# EAGLE design universal_opamp_circuit_REV1 (EAGLE 7.5.0)
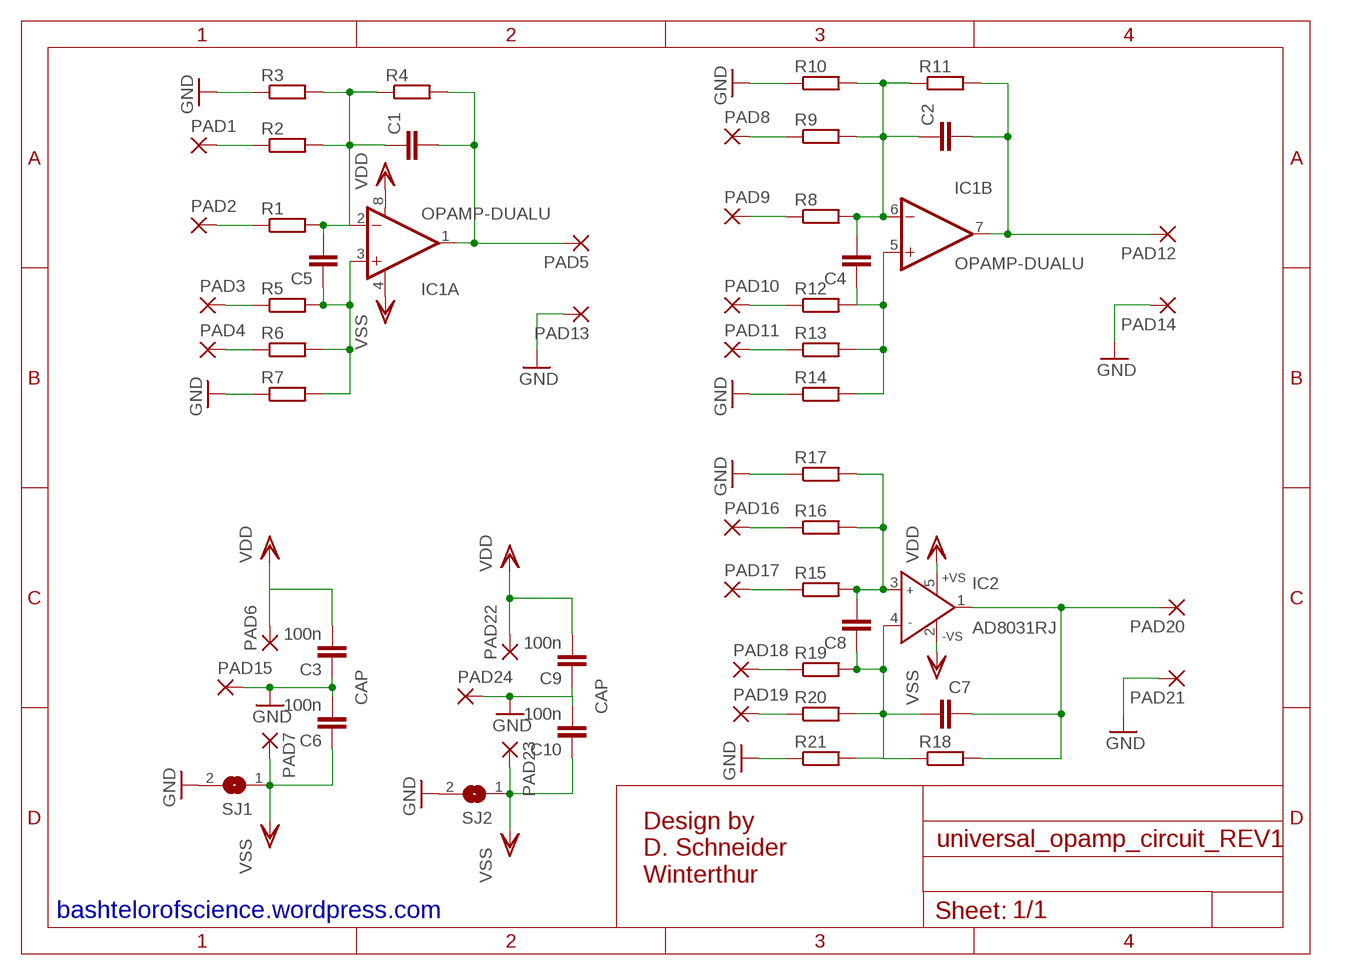
[diagram p0: schematic, sheet 1]

## Parts
C1  C-EUC0603  [C0603]
C2  C-EUC0603  [C0603]
C3  100n  C-EUC0603  [C0603]
C4  C-EUC0603  [C0603]
C5  C-EUC0603  [C0603]
C6  100n  C-EUC0603  [C0603]
C7  C-EUC0603  [C0603]
C8  C-EUC0603  [C0603]
C9  100n  C-EUC0603  [C0603]
C10  100n  C-EUC0603  [C0603]
IC1  OPAMP-DUALU  [SO08]
IC2  AD8031RJ  [SOT23-5]
PAD1  1,6/0,9  [1,6/0,9]
PAD2  1,6/0,9  [1,6/0,9]
PAD3  1,6/0,9  [1,6/0,9]
PAD4  1,6/0,9  [1,6/0,9]
PAD5  1,6/0,9  [1,6/0,9]
PAD6  1,6/0,9  [1,6/0,9]
PAD7  1,6/0,9  [1,6/0,9]
PAD8  1,6/0,9  [1,6/0,9]
PAD9  1,6/0,9  [1,6/0,9]
PAD10  1,6/0,9  [1,6/0,9]
PAD11  1,6/0,9  [1,6/0,9]
PAD12  1,6/0,9  [1,6/0,9]
PAD13  1,6/0,9  [1,6/0,9]
PAD14  1,6/0,9  [1,6/0,9]
PAD15  1,6/0,9  [1,6/0,9]
PAD16  1,6/0,9  [1,6/0,9]
PAD17  1,6/0,9  [1,6/0,9]
PAD18  1,6/0,9  [1,6/0,9]
PAD19  1,6/0,9  [1,6/0,9]
PAD20  1,6/0,9  [1,6/0,9]
PAD21  1,6/0,9  [1,6/0,9]
PAD22  1,6/0,9  [1,6/0,9]
PAD23  1,6/0,9  [1,6/0,9]
PAD24  1,6/0,9  [1,6/0,9]
R1  R-EU_R0603  [R0603]
R2  R-EU_R0603  [R0603]
R3  R-EU_R0603  [R0603]
R4  R-EU_R0603  [R0603]
R5  R-EU_R0603  [R0603]
R6  R-EU_R0603  [R0603]
R7  R-EU_R0603  [R0603]
R8  R-EU_R0603  [R0603]
R9  R-EU_R0603  [R0603]
R10  R-EU_R0603  [R0603]
R11  R-EU_R0603  [R0603]
R12  R-EU_R0603  [R0603]
R13  R-EU_R0603  [R0603]
R14  R-EU_R0603  [R0603]
R15  R-EU_R0603  [R0603]
R16  R-EU_R0603  [R0603]
R17  R-EU_R0603  [R0603]
R18  R-EU_R0603  [R0603]
R19  R-EU_R0603  [R0603]
R20  R-EU_R0603  [R0603]
R21  R-EU_R0603  [R0603]
SJ1  SJ  [SJ]
SJ2  SJ  [SJ]

## Nets
GND: C3.1 C6.2 C9.1 C10.2 PAD13.1(P) PAD14.1(P) PAD15.1(P) PAD21.1(P) PAD24.1(P) R3.1 R7.1 R10.1 R14.1 R17.1 R21.1 SJ1.2 SJ2.2
N$1: C2.1 C4.2 IC1.6(B:-IN) R8.2 R9.2 R10.2 R11.1
N$2: C2.2 IC1.7(B:OUT) PAD12.1(P) R11.2
N$3: PAD1.1(P) R2.1
N$4: C4.1 IC1.5(B:+IN) R12.2 R13.2 R14.2
N$5: C5.1 IC1.3(A:+IN) R5.2 R6.2 R7.2
N$6: PAD2.1(P) R1.1
N$7: PAD3.1(P) R5.1
N$8: PAD4.1(P) R6.1
N$9: PAD8.1(P) R9.1
N$10: PAD11.1(P) R13.1
N$11: C8.2 IC2.3(IN+) R15.2 R16.2 R17.2
N$12: C7.2 IC2.1(OUT) PAD20.1(P) R18.2
N$13: C1.1 C5.2 IC1.2(A:-IN) R1.2 R2.2 R3.2 R4.1
N$14: C1.2 IC1.1(A:OUT) PAD5.1(P) R4.2
N$15: PAD9.1(P) R8.1
N$16: PAD10.1(P) R12.1
N$17: C7.1 C8.1 IC2.4(IN-) R18.1 R19.2 R20.2 R21.2
N$18: PAD16.1(P) R16.1
N$19: PAD17.1(P) R15.1
N$20: PAD18.1(P) R19.1
N$21: PAD19.1(P) R20.1
VDD: C3.2 C9.2 IC1.8(A:V+) IC2.5(+VS) PAD6.1(P) PAD22.1(P)
VSS: C6.1 C10.1 IC1.4(A:V-) IC2.2(-VS) PAD7.1(P) PAD23.1(P) SJ1.1 SJ2.1

## Notes on the sheet
- CAP
- CAP
- Design by
  D. Schneider
  Winterthur
- bashtelorofscience.wordpress.com

## Library data of the parts
C1-C10 = resistor:C-EU: CAPACITOR, European symbol
IC1 = SparkFun-AnalogIC:OPAMP-DUAL: Generic op-amp footprint
IC2 = analog-devices:AD8031: 2.7 V, 800 ?A, 80 MHz Rail-to-Rail I/O Amplifiers Source: http://www.analog.com/static/imported-files/data_sheets/AD8031_8032.pdf; MPN: AD8031ARTZ-REEL7; OC_FARNELL: 1660972; OC_NEWARK: 84R8399
PAD1-PAD24 = wirepad:1,6/0,9: THROUGH-HOLE PAD
R1-R21 = resistor:R-EU_: RESISTOR, European symbol
SJ1 SJ2 = jumper:SJ: SMD solder JUMPER

## Board
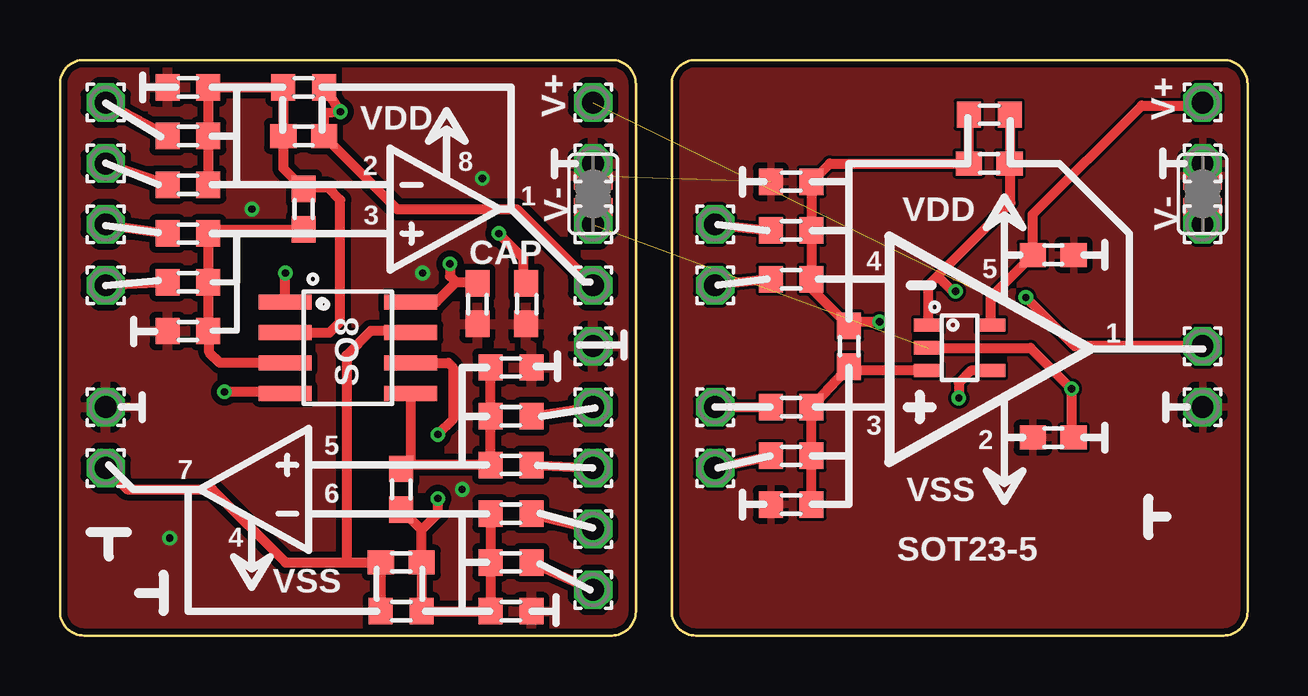
[diagram p1: board, top side]
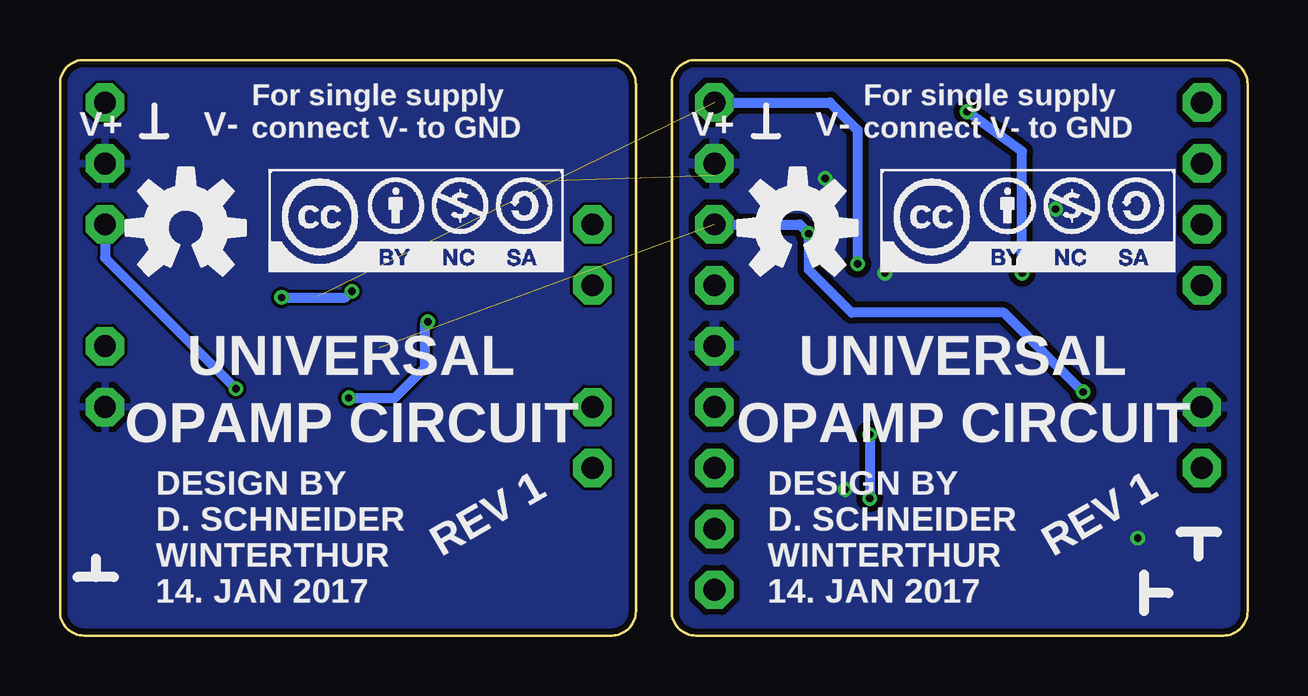
[diagram p2: board, bottom side, seen from below]

Size 49.5 x 24 mm. Coordinates in mm from the lower left corner, seen from the top.
Outline: 0,23 0,1 arc90 1,0 23,0 arc90 24,1 24,23 arc90 23,24 1,24 arc90 0,23
Outline: 25.5,23 25.5,1 arc90 26.5,0 48.5,0 arc90 49.5,1 49.5,23 arc90 48.5,24 26.5,24 arc90 25.5,23
Copper layers (1*16): Top 0.035mm / dielectric 1.5mm / Bottom 0.035mm
Design rules "dirt_cheap_dirty_boards.v1": minimum track width 5mil, minimum drill 12mil, track to track 5mil, track to pad 5mil, pad to pad 5mil, via to via 5mil, smd to smd 0mil, copper to edge 10mil, drill to drill 10mil, minimum pad ring 10mil, minimum via ring 6mil, stop-mask expansion 2mil, vias tented up to drill 25mil, thermal gap 10mil

### Footprints (pad centres in the part's own frame; a part is rotated, then mirrored left to right if it is on the bottom)
C0603 = smd 1.1 x 1: 1 -0.85,0; 2 0.85,0
SO08 = smd 0.61 x 2.21: 1 -1.905,-2.616; 2 -0.635,-2.616; 3 0.635,-2.616; 4 1.905,-2.616; 5 1.905,2.616; 6 0.635,2.616; 7 -0.635,2.616; 8 -1.905,2.616
SOT23-5 = smd 0.55 x 1.2: 1 -0.95,-1.3; 2 0,-1.3; 3 0.95,-1.3; 4 0.95,1.3; 5 -0.95,1.3
1,6/0,9 = drill 0.914 pad 1.6 octagon: 1 0,0
R0603 = smd 1 x 1.1: 1 -0.85,0; 2 0.85,0
SJ = smd 1.168 x 1.6: 1 -0.762,0; 2 0.762,0

### Placement (x,y rotation side)
C1  10.16,20.83 0 top
C2  14.22,3.05 180 top
C3  17.4,13.84 90 top
C4  14.22,6.1 270 top
C5  10.16,17.78 90 top
C6  19.43,13.84 270 top
C7  38.73,19.68 0 top
C8  32.89,12.06 270 top
C9  41.4,15.88 180 top
C10  41.4,8.26 180 top
IC1  12,12 270 top
IC2  37.5,12 270 top
PAD1  1.91,22.23 0 top
PAD2  1.91,19.68 0 top
PAD3  1.91,17.14 0 top
PAD4  1.91,14.61 0 top
PAD5  22.23,14.61 0 top
PAD6  22.23,22.23 0 top
PAD7  22.23,17.14 0 top
PAD8  22.23,1.91 0 top
PAD9  22.23,4.45 0 top
PAD10  22.23,6.99 0 top
PAD11  22.23,9.53 0 top
PAD12  1.91,6.99 0 top
PAD13  1.91,9.53 0 top
PAD14  22.23,12.06 0 top
PAD15  22.23,19.68 0 top
PAD16  27.3,6.99 0 top
PAD17  27.3,9.53 0 top
PAD18  27.3,14.61 0 top
PAD19  27.3,17.14 0 top
PAD20  47.62,12.06 0 top
PAD21  47.62,9.53 0 top
PAD22  47.62,22.23 0 top
PAD23  47.62,17.14 0 top
PAD24  47.62,19.68 0 top
R1  5.33,18.8 0 top
R2  5.33,20.83 0 top
R3  5.33,22.86 0 top
R4  10.16,22.86 0 top
R5  5.33,16.76 0 top
R6  5.33,14.73 0 top
R7  5.33,12.7 0 top
R8  18.8,5.08 180 top
R9  18.8,3.05 180 top
R10  18.8,1.02 180 top
R11  14.22,1.02 180 top
R12  18.8,7.11 180 top
R13  18.8,9.14 180 top
R14  18.8,11.18 180 top
R15  30.48,9.53 0 top
R16  30.48,7.49 0 top
R17  30.48,5.46 0 top
R18  38.73,21.72 0 top
R19  30.48,14.86 0 top
R20  30.48,16.89 0 top
R21  30.48,18.92 0 top
SJ1  22.23,18.41 90 top
SJ2  47.62,18.41 90 top
U$1  [CC-BY-NC-SA]  40.79,15.18 0 bottom
U$2  [OSHW-LOGO-M]  44.25,17 0 bottom
U$3  [OSHW-LOGO-M]  18.75,17 0 bottom
U$4  [CC-BY-NC-SA]  15.29,15.18 0 bottom

### Tracks (layer width: path | path; a pad name or v marks a point on that pad's centre or on a via)
GND  (via drill 0.3)  (1 unrouted)
  other vias: 15.11,15.11 16.76,6.1 8,17.78 4.57,4.06 17.6,19.06
  pour Top (isolate 0.254): 0,24 24,24 24,0 0,0
  pour Bottom (isolate 0.254): 0,24 0,0 24,0 24,24
  pour Bottom: 25.4,24.13 49.53,24.13 49.53,0 25.4,0
  pour Top: 25.4,24.13 49.53,24.13 49.53,0 25.4,0
N$1  (via drill 0.3)
  Top 0.406: 15.07,4.4 C2.1 R11.1 R10.2 R9.2 R8.2 | 15.07,4.4 C4.2 | IC1.6 16.19,11.37 16.38,11.18 16.38,9.02 v15.75,8.38 | 15.07,4.4 15.75,5.07 v15.75,5.71
  Bottom 0.406: v15.75,8.38 v15.75,5.71
N$2
  Top 0.406: PAD12.1 2.79,6.1 6.35,6.1 9.4,3.05 11.94,3.05 | 11.94,3.05 C2.2 R11.2 | IC1.7 14.55,12.7 12.95,12.7 11.94,11.68 11.94,3.05
N$3
  Top 0.406: PAD1.1 R2.1
N$4
  Top 0.406: R14.2 R13.2 R12.2 14.39,7.11 arc90 C4.1 14.62,7.34 IC1.5
N$5
  Top 0.406: IC1.3 6.67,11.37 6.22,11.81 6.22,12.66 R7.2 R6.2 R5.2 6.35,16.93 C5.1
N$6
  Top 0.406: PAD2.1 R1.1
N$7
  Top 0.406: PAD3.1 R5.1
N$8
  Top 0.406: PAD4.1 R6.1
N$9
  Top 0.406: R9.1 PAD8.1
N$10
  Top 0.406: R13.1 PAD11.1
N$11
  Top 0.406: R17.2 R16.2 R15.2 C8.2 33.06,11.05 IC2.3
N$12  (via drill 0.3)
  Top 0.406: R18.2 C7.2 39.62,19.65 39.62,18.03 36.58,14.99 | IC2.1 36.2,14.61 36.58,14.99 | PAD20.1 42.29,12.06 v40.26,14.1 | v37.34,14.35 37.21,14.35 36.58,14.99
  Bottom 0.406: v40.26,14.1 37.59,14.1 v37.34,14.35
N$13
  Top 0.406: R1.2 R2.2 R3.2 R4.1 C1.1 9.31,19.48 C5.2 10.2,18.67 11.18,18.67 11.68,18.16 11.68,13.08 11.24,12.63 IC1.2
N$14  (via drill 0.3)
  Top 0.406: IC1.1 9.38,15.1 v9.4,15.11 | R4.2 11.05,22.82 v11.68,21.84 11.01,21.8 C1.2 14.06,17.78 19.05,17.78 PAD5.1
  Bottom 0.406: v9.4,15.11 9.4,20.19 v11.68,21.84
N$15
  Top 0.406: R8.1 PAD9.1
N$16
  Top 0.406: R12.1 PAD10.1
N$17  (via drill 0.3)
  Top 0.406: R18.1 C7.1 32.09,19.68 R21.2 R20.2 R19.2 31.33,14.48 C8.1 33.06,13.08 v34.16,13.08 | IC2.4 37.97,11.05 37.47,10.54 v37.47,9.91
  Bottom 0.406: v37.47,9.91 35.56,9.91 34.29,11.18 34.29,12.95 v34.16,13.08
N$18
  Top 0.406: PAD16.1 R16.1
N$19
  Top 0.406: PAD17.1 R15.1
N$20
  Top 0.406: R19.1 PAD18.1
N$21
  Top 0.406: PAD19.1 R20.1
VDD  (via drill 0.3)  (1 unrouted)
  Top 0.406: IC1.8 15.68,13.9 16.51,14.73 | 16.51,14.73 17.36,14.73 C3.2 | v16.26,15.49 16.26,14.99 16.51,14.73 | PAD22.1 47.5,22.1 45.09,22.1 40.55,17.57 C9.2 38.8,14.12 IC2.5
  Bottom 0.406: PAD6.1 17.4,22.23 16.26,21.08 v16.26,15.49
VSS  (via drill 0.3)  (1 unrouted)
  Top 0.406: v18.29,16.76 19.3,15.75 19.3,14.82 C6.1 | IC1.4 9.32,10.16 v6.86,10.16 | PAD7.1 SJ1.1 | C10.1 42.16,8.34 v42.16,10.29 40.45,12 IC2.2 | PAD23.1 SJ2.1
  Bottom 0.406: PAD7.1 18.67,17.14 v18.29,16.76 18.29,15.24 16.51,13.46 10.16,13.46 v6.86,10.16 | PAD23.1 47.62,15.75 v42.16,10.29

### Text on the board
tNames: V+ | V+ | VDD | 2 | 8 | 1 | V- | 3 | VDD | V- | 4 | 5 | CAP | SO8 | 1 | 3 | 2 | 5 | 7 | VSS | 6 | 4 | VSS | SOT23-5
bNames: V- | V+ | V- | V+ | For single supply / connect V- to GND | For single supply / connect V- to GND | UNIVERSAL | UNIVERSAL | OPAMP CIRCUIT | OPAMP CIRCUIT | DESIGN BY | DESIGN BY | D. SCHNEIDER | D. SCHNEIDER | REV 1 | WINTERTHUR | REV 1 | WINTERTHUR | 14. JAN 2017 | 14. JAN 2017
tStop: bashtelorofscience.wordpress.com